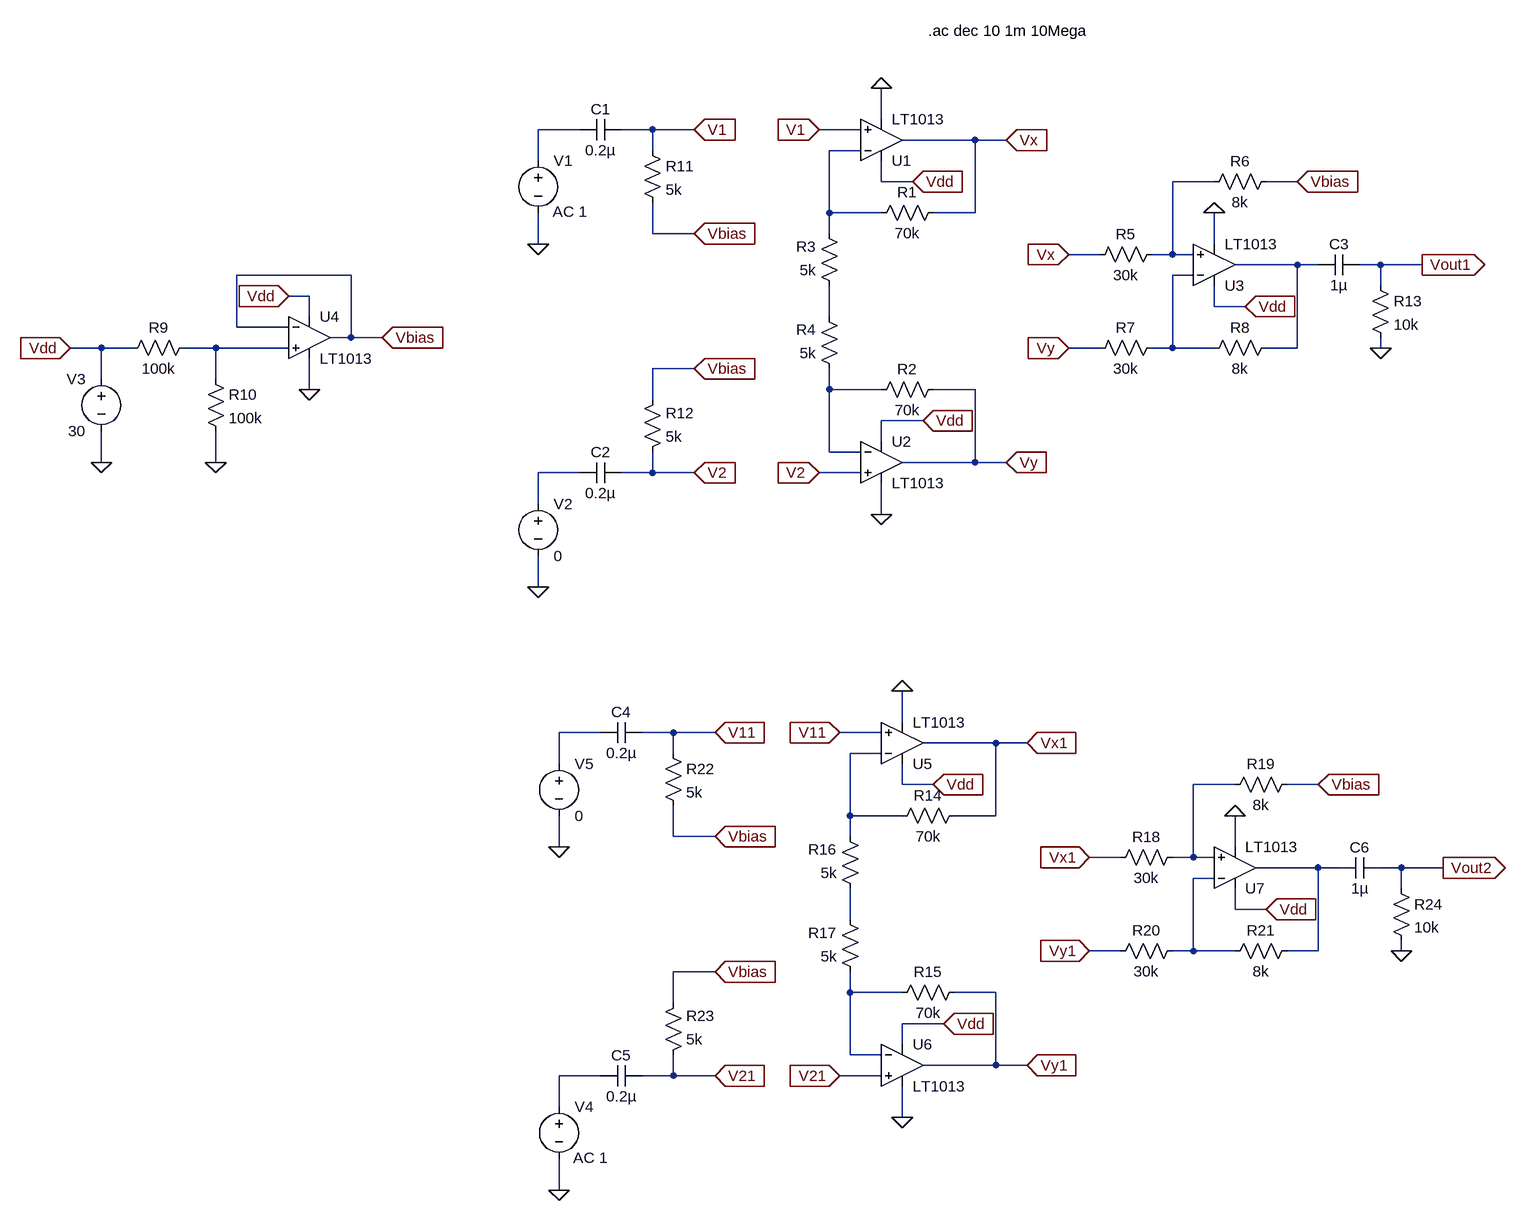
[diagram p0: schematic Q2.1.asc]
Q2.1.asc, the LTspice schematic file:
Version 4
SHEET 1 1124 1728
WIRE 144 64 144 16
WIRE -320 80 -384 80
WIRE -208 80 -256 80
WIRE -144 80 -208 80
WIRE 112 80 48 80
WIRE 288 96 176 96
WIRE 336 96 288 96
WIRE -208 112 -208 80
WIRE 112 112 64 112
WIRE -384 128 -384 80
WIRE 144 160 144 128
WIRE 192 160 144 160
WIRE 656 160 592 160
WIRE 784 160 736 160
WIRE 64 208 64 112
WIRE 144 208 64 208
WIRE 288 208 288 96
WIRE 288 208 224 208
WIRE -208 240 -208 192
WIRE -144 240 -208 240
WIRE 64 240 64 208
WIRE -384 256 -384 208
WIRE 656 256 656 208
WIRE 480 272 432 272
WIRE 592 272 592 160
WIRE 592 272 560 272
WIRE 624 272 592 272
WIRE 784 288 688 288
WIRE 816 288 784 288
WIRE 912 288 880 288
WIRE 976 288 912 288
WIRE -672 304 -848 304
WIRE 624 304 592 304
WIRE 912 320 912 288
WIRE -736 336 -768 336
WIRE 656 352 656 320
WIRE 704 352 656 352
WIRE -736 368 -736 336
WIRE 64 368 64 320
WIRE -848 384 -848 304
WIRE -768 384 -848 384
WIRE -672 400 -672 304
WIRE -672 400 -704 400
WIRE -624 400 -672 400
WIRE -1056 416 -1104 416
WIRE -1008 416 -1056 416
WIRE -880 416 -928 416
WIRE -768 416 -880 416
WIRE 480 416 432 416
WIRE 592 416 592 304
WIRE 592 416 560 416
WIRE 656 416 592 416
WIRE 784 416 784 288
WIRE 784 416 736 416
WIRE 912 416 912 400
WIRE -144 448 -208 448
WIRE -1056 464 -1056 416
WIRE -880 464 -880 416
WIRE -736 480 -736 432
WIRE 64 480 64 448
WIRE 144 480 64 480
WIRE 288 480 224 480
WIRE -208 496 -208 448
WIRE 208 528 144 528
WIRE 144 560 144 528
WIRE 64 576 64 480
WIRE 112 576 64 576
WIRE -1056 592 -1056 544
WIRE -880 592 -880 544
WIRE 288 592 288 480
WIRE 288 592 176 592
WIRE 336 592 288 592
WIRE -320 608 -384 608
WIRE -208 608 -208 576
WIRE -208 608 -256 608
WIRE -144 608 -208 608
WIRE 112 608 48 608
WIRE -384 656 -384 608
WIRE 144 672 144 624
WIRE -384 784 -384 736
WIRE 176 992 176 944
WIRE -288 1008 -352 1008
WIRE -176 1008 -224 1008
WIRE -112 1008 -176 1008
WIRE 144 1008 80 1008
WIRE 320 1024 208 1024
WIRE 368 1024 320 1024
WIRE -176 1040 -176 1008
WIRE 144 1040 96 1040
WIRE -352 1056 -352 1008
WIRE 176 1088 176 1056
WIRE 224 1088 176 1088
WIRE 688 1088 624 1088
WIRE 816 1088 768 1088
WIRE 96 1136 96 1040
WIRE 176 1136 96 1136
WIRE 320 1136 320 1024
WIRE 320 1136 256 1136
WIRE -176 1168 -176 1120
WIRE -112 1168 -176 1168
WIRE 96 1168 96 1136
WIRE -352 1184 -352 1136
WIRE 688 1184 688 1136
WIRE 512 1200 464 1200
WIRE 624 1200 624 1088
WIRE 624 1200 592 1200
WIRE 656 1200 624 1200
WIRE 816 1216 720 1216
WIRE 848 1216 816 1216
WIRE 944 1216 912 1216
WIRE 1008 1216 944 1216
WIRE 656 1232 624 1232
WIRE 944 1248 944 1216
WIRE 688 1280 688 1248
WIRE 736 1280 688 1280
WIRE 96 1296 96 1248
WIRE 512 1344 464 1344
WIRE 624 1344 624 1232
WIRE 624 1344 592 1344
WIRE 688 1344 624 1344
WIRE 816 1344 816 1216
WIRE 816 1344 768 1344
WIRE 944 1344 944 1328
WIRE -112 1376 -176 1376
WIRE 96 1408 96 1376
WIRE 176 1408 96 1408
WIRE 320 1408 256 1408
WIRE -176 1424 -176 1376
WIRE 240 1456 176 1456
WIRE 176 1488 176 1456
WIRE 96 1504 96 1408
WIRE 144 1504 96 1504
WIRE 320 1520 320 1408
WIRE 320 1520 208 1520
WIRE 368 1520 320 1520
WIRE -288 1536 -352 1536
WIRE -176 1536 -176 1504
WIRE -176 1536 -224 1536
WIRE -112 1536 -176 1536
WIRE 144 1536 80 1536
WIRE -352 1584 -352 1536
WIRE 176 1600 176 1552
WIRE -352 1712 -352 1664
FLAG 48 80 V1
IOPIN 48 80 In
FLAG 48 608 V2
IOPIN 48 608 In
FLAG 144 16 0
FLAG 144 672 0
FLAG 208 528 Vdd
IOPIN 208 528 In
FLAG 192 160 Vdd
IOPIN 192 160 In
FLAG 336 96 Vx
IOPIN 336 96 In
FLAG 336 592 Vy
IOPIN 336 592 In
FLAG 976 288 Vout1
IOPIN 976 288 Out
FLAG 432 272 Vx
IOPIN 432 272 In
FLAG 432 416 Vy
IOPIN 432 416 In
FLAG 656 208 0
FLAG 704 352 Vdd
IOPIN 704 352 In
FLAG -1056 592 0
FLAG -880 592 0
FLAG -736 480 0
FLAG -1104 416 Vdd
IOPIN -1104 416 In
FLAG -624 400 Vbias
IOPIN -624 400 In
FLAG -768 336 Vdd
IOPIN -768 336 In
FLAG 784 160 Vbias
IOPIN 784 160 In
FLAG -384 256 0
FLAG -384 784 0
FLAG -144 80 V1
IOPIN -144 80 In
FLAG -144 608 V2
IOPIN -144 608 In
FLAG -144 240 Vbias
IOPIN -144 240 In
FLAG -144 448 Vbias
IOPIN -144 448 In
FLAG 912 416 0
FLAG 80 1008 V11
IOPIN 80 1008 In
FLAG 80 1536 V21
IOPIN 80 1536 In
FLAG 176 944 0
FLAG 176 1600 0
FLAG 240 1456 Vdd
IOPIN 240 1456 In
FLAG 224 1088 Vdd
IOPIN 224 1088 In
FLAG 368 1024 Vx1
IOPIN 368 1024 In
FLAG 368 1520 Vy1
IOPIN 368 1520 In
FLAG 1008 1216 Vout2
IOPIN 1008 1216 Out
FLAG 464 1200 Vx1
IOPIN 464 1200 In
FLAG 464 1344 Vy1
IOPIN 464 1344 In
FLAG 688 1136 0
FLAG 736 1280 Vdd
IOPIN 736 1280 In
FLAG 816 1088 Vbias
IOPIN 816 1088 In
FLAG -352 1184 0
FLAG -352 1712 0
FLAG -112 1008 V11
IOPIN -112 1008 In
FLAG -112 1536 V21
IOPIN -112 1536 In
FLAG -112 1168 Vbias
IOPIN -112 1168 In
FLAG -112 1376 Vbias
IOPIN -112 1376 In
FLAG 944 1344 0
SYMBOL opamps/LT1013 144 160 M180
SYMATTR InstName U1
SYMBOL opamps/LT1013 144 528 R0
SYMATTR InstName U2
SYMBOL opamps/LT1013 656 352 M180
SYMATTR InstName U3
SYMBOL res 240 192 R90
WINDOW 0 0 56 VBottom 2
WINDOW 3 32 56 VTop 2
SYMATTR InstName R1
SYMATTR Value 70k
SYMBOL res 240 464 R90
WINDOW 0 0 56 VBottom 2
WINDOW 3 32 56 VTop 2
SYMATTR InstName R2
SYMATTR Value 70k
SYMBOL res 80 336 R180
WINDOW 0 36 76 Left 2
WINDOW 3 36 40 Left 2
SYMATTR InstName R3
SYMATTR Value 5k
SYMBOL res 80 464 R180
WINDOW 0 36 76 Left 2
WINDOW 3 36 40 Left 2
SYMATTR InstName R4
SYMATTR Value 5k
SYMBOL res 576 256 R90
WINDOW 0 0 56 VBottom 2
WINDOW 3 32 56 VTop 2
SYMATTR InstName R5
SYMATTR Value 30k
SYMBOL res 752 144 R90
WINDOW 0 0 56 VBottom 2
WINDOW 3 32 56 VTop 2
SYMATTR InstName R6
SYMATTR Value 8k
SYMBOL res 576 400 R90
WINDOW 0 0 56 VBottom 2
WINDOW 3 32 56 VTop 2
SYMATTR InstName R7
SYMATTR Value 30k
SYMBOL res 752 400 R90
WINDOW 0 0 56 VBottom 2
WINDOW 3 32 56 VTop 2
SYMATTR InstName R8
SYMATTR Value 8k
SYMBOL voltage -1056 448 M0
SYMATTR InstName V3
SYMATTR Value 30
SYMBOL res -1024 432 R270
WINDOW 0 32 56 VTop 2
WINDOW 3 0 56 VBottom 2
SYMATTR InstName R9
SYMATTR Value 100k
SYMBOL res -896 448 R0
SYMATTR InstName R10
SYMATTR Value 100k
SYMBOL opamps/LT1013 -736 336 R0
SYMATTR InstName U4
SYMBOL cap -256 64 R90
WINDOW 0 0 32 VBottom 2
WINDOW 3 32 32 VTop 2
SYMATTR InstName C1
SYMATTR Value 0.2µ
SYMBOL cap -256 592 R90
WINDOW 0 0 32 VBottom 2
WINDOW 3 32 32 VTop 2
SYMATTR InstName C2
SYMATTR Value 0.2µ
SYMBOL res -224 96 R0
SYMATTR InstName R11
SYMATTR Value 5k
SYMBOL res -224 592 M180
WINDOW 0 36 76 Left 2
WINDOW 3 36 40 Left 2
SYMATTR InstName R12
SYMATTR Value 5k
SYMBOL res 896 304 R0
SYMATTR InstName R13
SYMATTR Value 10k
SYMBOL cap 880 272 R90
WINDOW 0 0 32 VBottom 2
WINDOW 3 32 32 VTop 2
SYMATTR InstName C3
SYMATTR Value 1µ
SYMBOL voltage -384 112 R0
WINDOW 123 22 94 Left 2
SYMATTR Value2 AC 1
SYMATTR InstName V1
SYMATTR Value ""
SYMBOL voltage -384 640 R0
SYMATTR InstName V2
SYMATTR Value 0
SYMBOL opamps/LT1013 176 1088 M180
SYMATTR InstName U5
SYMBOL opamps/LT1013 176 1456 R0
SYMATTR InstName U6
SYMBOL opamps/LT1013 688 1280 M180
SYMATTR InstName U7
SYMBOL res 272 1120 R90
WINDOW 0 0 56 VBottom 2
WINDOW 3 32 56 VTop 2
SYMATTR InstName R14
SYMATTR Value 70k
SYMBOL res 272 1392 R90
WINDOW 0 0 56 VBottom 2
WINDOW 3 32 56 VTop 2
SYMATTR InstName R15
SYMATTR Value 70k
SYMBOL res 112 1264 R180
WINDOW 0 36 76 Left 2
WINDOW 3 36 40 Left 2
SYMATTR InstName R16
SYMATTR Value 5k
SYMBOL res 112 1392 R180
WINDOW 0 36 76 Left 2
WINDOW 3 36 40 Left 2
SYMATTR InstName R17
SYMATTR Value 5k
SYMBOL res 608 1184 R90
WINDOW 0 0 56 VBottom 2
WINDOW 3 32 56 VTop 2
SYMATTR InstName R18
SYMATTR Value 30k
SYMBOL res 784 1072 R90
WINDOW 0 0 56 VBottom 2
WINDOW 3 32 56 VTop 2
SYMATTR InstName R19
SYMATTR Value 8k
SYMBOL res 608 1328 R90
WINDOW 0 0 56 VBottom 2
WINDOW 3 32 56 VTop 2
SYMATTR InstName R20
SYMATTR Value 30k
SYMBOL res 784 1328 R90
WINDOW 0 0 56 VBottom 2
WINDOW 3 32 56 VTop 2
SYMATTR InstName R21
SYMATTR Value 8k
SYMBOL cap -224 992 R90
WINDOW 0 0 32 VBottom 2
WINDOW 3 32 32 VTop 2
SYMATTR InstName C4
SYMATTR Value 0.2µ
SYMBOL cap -224 1520 R90
WINDOW 0 0 32 VBottom 2
WINDOW 3 32 32 VTop 2
SYMATTR InstName C5
SYMATTR Value 0.2µ
SYMBOL res -192 1024 R0
SYMATTR InstName R22
SYMATTR Value 5k
SYMBOL res -192 1520 M180
WINDOW 0 36 76 Left 2
WINDOW 3 36 40 Left 2
SYMATTR InstName R23
SYMATTR Value 5k
SYMBOL res 928 1232 R0
SYMATTR InstName R24
SYMATTR Value 10k
SYMBOL cap 912 1200 R90
WINDOW 0 0 32 VBottom 2
WINDOW 3 32 32 VTop 2
SYMATTR InstName C6
SYMATTR Value 1µ
SYMBOL voltage -352 1568 R0
WINDOW 123 22 94 Left 2
SYMATTR Value2 AC 1
SYMATTR InstName V4
SYMATTR Value ""
SYMBOL voltage -352 1040 R0
SYMATTR InstName V5
SYMATTR Value 0
TEXT 216 -72 Left 2 !.ac dec 10 1m 10Mega

The netlist it stands for:
* Q2.1.asc
XU1 V1 N002 Vdd 0 Vx LT1013  ; pins In+ In- V+ V- OUT
XU2 V2 N008 Vdd 0 Vy LT1013  ; pins In+ In- V+ V- OUT
XU3 N003 N005 Vdd 0 N004 LT1013  ; pins In+ In- V+ V- OUT
R1 Vx N002 70k
R2 Vy N008 70k
R3 N006 N002 5k
R4 N008 N006 5k
R5 N003 Vx 30k
R6 Vbias N003 8k
R7 N005 Vy 30k
R8 N004 N005 8k
V3 Vdd 0 30
R9 Vdd N007 100k
R10 N007 0 100k
XU4 N007 Vbias Vdd 0 Vbias LT1013  ; pins In+ In- V+ V- OUT
C1 V1 N001 0.2µ
C2 V2 N009 0.2µ
R11 V1 Vbias 5k
R12 V2 Vbias 5k
R13 Vout1 0 10k
C3 Vout1 N004 1µ
V1 N001 0 AC 1
V2 N009 0 0
XU5 V11 N011 Vdd 0 Vx1 LT1013  ; pins In+ In- V+ V- OUT
XU6 V21 N016 Vdd 0 Vy1 LT1013  ; pins In+ In- V+ V- OUT
XU7 N012 N014 Vdd 0 N013 LT1013  ; pins In+ In- V+ V- OUT
R14 Vx1 N011 70k
R15 Vy1 N016 70k
R16 N015 N011 5k
R17 N016 N015 5k
R18 N012 Vx1 30k
R19 Vbias N012 8k
R20 N014 Vy1 30k
R21 N013 N014 8k
C4 V11 N010 0.2µ
C5 V21 N017 0.2µ
R22 V11 Vbias 5k
R23 V21 Vbias 5k
R24 Vout2 0 10k
C6 Vout2 N013 1µ
V4 N017 0 AC 1
V5 N010 0 0
.ac dec 10 1m 10Mega
.lib LTC.lib
.backanno
.end